# Altium project TSAL(2024).PrjPcb
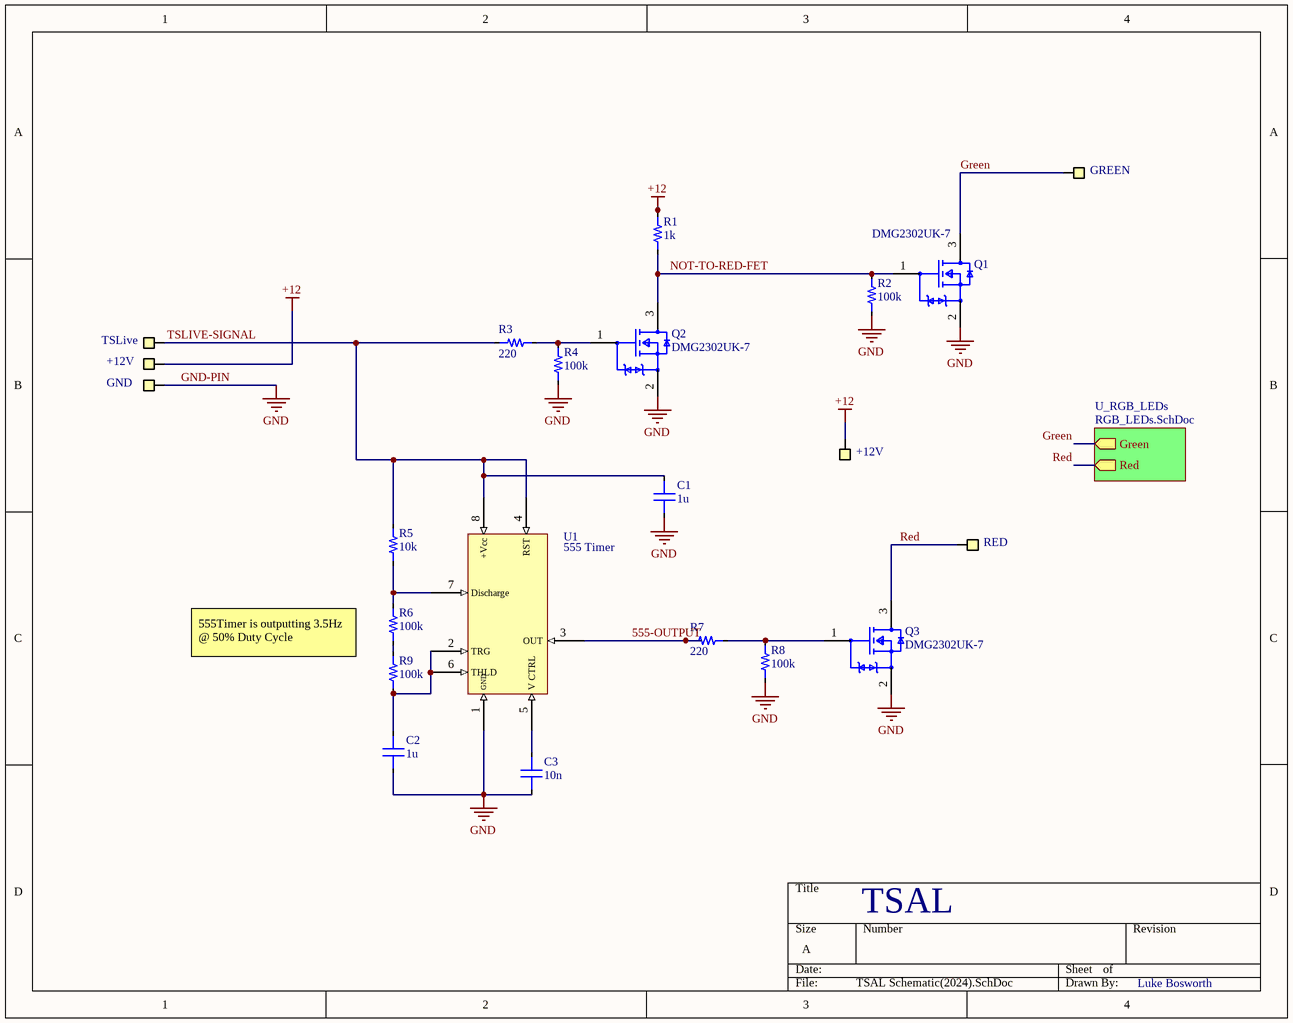
[diagram p0: TSAL Schematic(2024).SchDoc]
2 sheets, 52 parts. Net scope: hierarchical (ports join the sheet entries above them; power ports are global).
Board file: TSAL_PCB(2024).PcbDoc
Sheets:
  TSAL Schematic(2024).SchDoc
    U_RGB_LEDs = RGB_LEDs.SchDoc

## Sheet TSAL Schematic(2024).SchDoc
size A

### Parts
(Parts that share a designator on the sheet are numbered #1, #2 ... from top to bottom, then left to right.)
C1  1u  [0603_CAP]
C2  1u  [0603_CAP]
C3  10n  [0603_CAP]
Q1  DMG2302UK-7  [SOT23-3]
Q2  DMG2302UK-7  [SOT23-3]
Q3  DMG2302UK-7  [SOT23-3]
R1#1  1k  [0603_RES]
R2#1  100k  [0603_RES]
R3#1  220  [0603_RES]
R4#1  100k  [0603_RES]
R5#1  10k  [0603_RES]
R6#1  value 100k  [0603_RES]  (hidden comment: Resistor)
R7#1  220  [0603_RES]
R8#1  100k  [0603_RES]
R9#1  100k  [0603_RES]
U1  555 Timer  [SOIC-8]
X1  GenericPinHeader(0.1in)  [GenericPinHeader(.1in)]  (value not drawn)
X2  GenericPinHeader(0.1in)  [GenericPinHeader(.1in)]  (value not drawn)
X3  GenericPinHeader(0.1in)  [GenericPinHeader(.1in)]  (value not drawn)
X4  GenericPinHeader(0.1in)  [GenericPinHeader(.1in)]  (value not drawn)
X5  GenericPinHeader(0.1in)  [GenericPinHeader(.1in)]  (value not drawn)
X6  GenericPinHeader(0.1in)  [GenericPinHeader(.1in)]  (value not drawn)

### Sub-sheets
U_RGB_LEDs = RGB_LEDs.SchDoc: Green (out), Red (out)

### Nets
+12: R1#1.1 X3.1(Pin) X5.1(Pin)
GND-PIN: C1.1 C2.1 C3.1 Q1.2(S) Q2.2(S) Q3.2(S) R2#1.2 R4#1.2 R8#1.2 U1.1(GND) X4.1(Pin)  [also labelled GND]
555-OUTPUT: R7#1.1 U1.3(OUT)
Green: Q1.3(D) X1.1(Pin) ; sheet U_RGB_LEDs/Green
NOT-TO-RED-FET: Q1.1(G) Q2.3(D) R1#1.2 R2#1.1
Red: Q3.3(D) X6.1(Pin) ; sheet U_RGB_LEDs/Red
TSLIVE-SIGNAL: C1.2 R3#1.1 R5#1.2 U1.4(RST) U1.8(+Vcc) X2.1(Pin)
NetC2_2: C2.2 R9#1.1 U1.2(TRG) U1.6(THLD)
NetC3_2: C3.2 U1.5(V_CTRL)
NetQ2_1: Q2.1(G) R3#1.2 R4#1.1
NetQ3_1: Q3.1(G) R7#1.2 R8#1.1
NetR5#1_1: R5#1.1 R6#1.2 U1.7(Discharge)
NetR6#1_1: R6#1.1 R9#1.2

### Notes on the sheet
- (near X1) GREEN
- TSLive
- +12V
- GND
- (near X5) +12V
- (near X6) RED
- 555Timer is outputting 3.5Hz @ 50% Duty Cycle
- TSAL
- Luke Bosworth

### Library data of the parts
C1-C3 = Capacitor: Dielectric: *; Percent Tolerance: *; ESR: *
  C1 C2: Value: 1u
  C3: Value: 10n
Q1-Q3 = CMP-12801-000001-1: MOSFET N-CH 20V 2.8A SOT23; Manufacturer: Diodes Inc.; Reverse Recovery Time: 5.3ns; Gate Charge At Vgs: 2.8nC @ 10V; Turn On Delay Time: 0.6ns; Pulse Drain Current: 12A; Max Forward Diode Voltage: 1.2V; Reverse Recovery Charge: 0.5nC; Automotive Grade: Grade 0; Threshold Vgs Min: 0.3V; Number Of N Channels: 1; Standoff Height: 0.013mm; Typ Forward Diode Voltage: 0.7V; Drain To Source Resistance: 61mΩ; Rthja Max: 192°C/W; Max Junction Temp: +150°C; Input Capacitace At Vds: 130pF @ 10V; Threshold Vgs Max: 1V; Turn Off Delay Time: 4.2ns; Depletion Mode: False; Gate To Source Voltage: 12V; Power Dissipation: 0.66W; Device Class L1: Discrete Semiconductors; Footprint Url: https://www.diodes.com/assets/Package-Files/SOT23.pdf; Lead Free: Yes; Manufacturer Part Number: DMG2302UK-7; Temperature Range High: +150°C; Drain To Source Voltage: 20V; Category: Trans; Digikey Description: MOSFET N-CH 20V 2.8A SOT23; RoHS: TRUE; Device Class L2: Transistors; Height: 1.1mm; Automotive: Yes; Package: SOT23; Drain To Source Breakdown Voltage: 20V; Continuous Drain Current: 2.8A; ComponentLink2Description: Datasheet; Device Class L3: MOSFETs; Octopart: https://octopart.com/dmg2302uk-7-diodes+inc.-73850182; Temperature Range Low: -55°C; Temperature: -55°C to +150°C; Number Of Channels: 1; ComponentLink2URL: https://www.diodes.com/assets/Datasheets/DMG2302UK.pdf
R1#1 R2#1 R3#1 R4#1 R5#1 R7#1 R8#1 R9#1 = Resistor: Tolerance: *
  R1#1: Value: 1k
  R2#1 R4#1 R8#1 R9#1: Value: 100k
  R3#1 R7#1: Value: 220
  R5#1: Value: 10k
U1 = LM555: Generic 555 timer IC; ComponentLink1Description: Digikey; ComponentLink1URL: https://www.digikey.com/en/products/detail/texas-instruments/NA555DR/1571933
X1-X6 = GenericPinHeader(0.1in): Generic .1in(2.54mm) pitch pin header
R6#1 = Resistor: Tolerance: *

## Sheet RGB_LEDs.SchDoc
size A
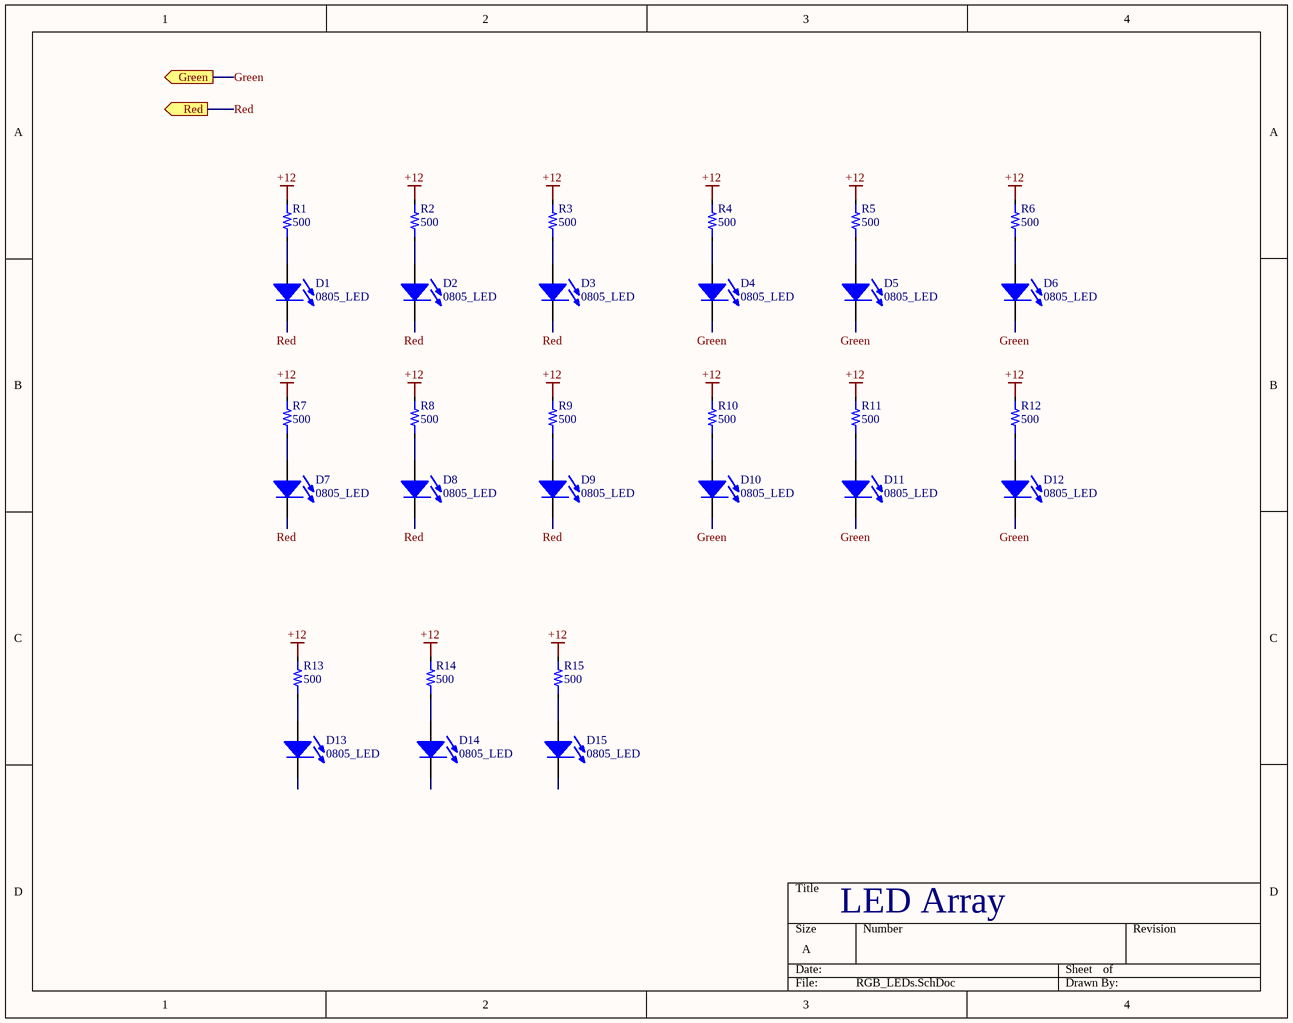
[diagram p1: RGB_LEDs.SchDoc]

### Parts
(Parts that share a designator on the sheet are numbered #1, #2 ... from top to bottom, then left to right.)
D1  0805_LED  [0805_LED]
D2  0805_LED  [0805_LED]
D3  0805_LED  [0805_LED]
D4  0805_LED  [0805_LED]
D5  0805_LED  [0805_LED]
D6  0805_LED  [0805_LED]
D7  0805_LED  [0805_LED]
D8  0805_LED  [0805_LED]
D9  0805_LED  [0805_LED]
D10  0805_LED  [0805_LED]
D11  0805_LED  [0805_LED]
D12  0805_LED  [0805_LED]
D13  0805_LED  [0805_LED]
D14  0805_LED  [0805_LED]
D15  0805_LED  [0805_LED]
R1#2  value 500  [0603_RES]  (hidden comment: Resistor)
R2#2  value 500  [0603_RES]  (hidden comment: Resistor)
R3#2  value 500  [0603_RES]  (hidden comment: Resistor)
R4#2  value 500  [0603_RES]  (hidden comment: Resistor)
R5#2  value 500  [0603_RES]  (hidden comment: Resistor)
R6#2  value 500  [0603_RES]  (hidden comment: Resistor)
R7#2  value 500  [0603_RES]  (hidden comment: Resistor)
R8#2  value 500  [0603_RES]  (hidden comment: Resistor)
R9#2  value 500  [0603_RES]  (hidden comment: Resistor)
R10  value 500  [0603_RES]  (hidden comment: Resistor)
R11  value 500  [0603_RES]  (hidden comment: Resistor)
R12  value 500  [0603_RES]  (hidden comment: Resistor)
R13  value 500  [0603_RES]  (hidden comment: Resistor)
R14  value 500  [0603_RES]  (hidden comment: Resistor)
R15  value 500  [0603_RES]  (hidden comment: Resistor)

### Ports
Green (out), Red (out)

### Nets
+12: R1#2.2 R2#2.2 R3#2.2 R4#2.2 R5#2.2 R6#2.2 R7#2.2 R8#2.2 R9#2.2 R10.2 R11.2 R12.2 R13.2 R14.2 R15.2
Green: D4.2(K) D5.2(K) D6.2(K) D10.2(K) D11.2(K) D12.2(K) ; port Green
Red: D1.2(K) D2.2(K) D3.2(K) D7.2(K) D8.2(K) D9.2(K) ; port Red
NetD1_1: D1.1(A) R1#2.1
NetD2_1: D2.1(A) R2#2.1
NetD3_1: D3.1(A) R3#2.1
NetD4_1: D4.1(A) R4#2.1
NetD5_1: D5.1(A) R5#2.1
NetD6_1: D6.1(A) R6#2.1
NetD7_1: D7.1(A) R7#2.1
NetD8_1: D8.1(A) R8#2.1
NetD9_1: D9.1(A) R9#2.1
NetD10_1: D10.1(A) R10.1
NetD11_1: D11.1(A) R11.1
NetD12_1: D12.1(A) R12.1
NetD13_1: D13.1(A) R13.1
NetD14_1: D14.1(A) R14.1
NetD15_1: D15.1(A) R15.1

Not connected (* = marked no-connect by the designer): D13 2(K); D14 2(K); D15 2(K)

### Notes on the sheet
- LED Array

### Library data of the parts
D1-D15 = 0805_LED: Generic 0805 LED
R1#2 R2#2 R3#2 R4#2 R5#2 R6#2 R7#2 R8#2 R9#2 R10-R15 = Resistor: Tolerance: *

## Nets that join several sheets
+12: TSAL Schematic(2024) (R1#1.1 X3.1 X5.1), RGB_LEDs (15 pins)
Green: TSAL Schematic(2024) (Q1.3 X1.1), RGB_LEDs (6 pins)
Red: TSAL Schematic(2024) (Q3.3 X6.1), RGB_LEDs (6 pins)